# Altium schematic sheet Структурная схема.SchDoc
size 420 x 297 mm; CheckedBy: С. И. Ян; Author: Я.В. Калистратов; CompanyName: ГУАП; DocumentNumber: 1; Revision: 1; SheetNumber: 1; SheetTotal: 1; Name2: контролера БПЛА; Name1: Структурная схема полётного; Parameter 1: вапвап
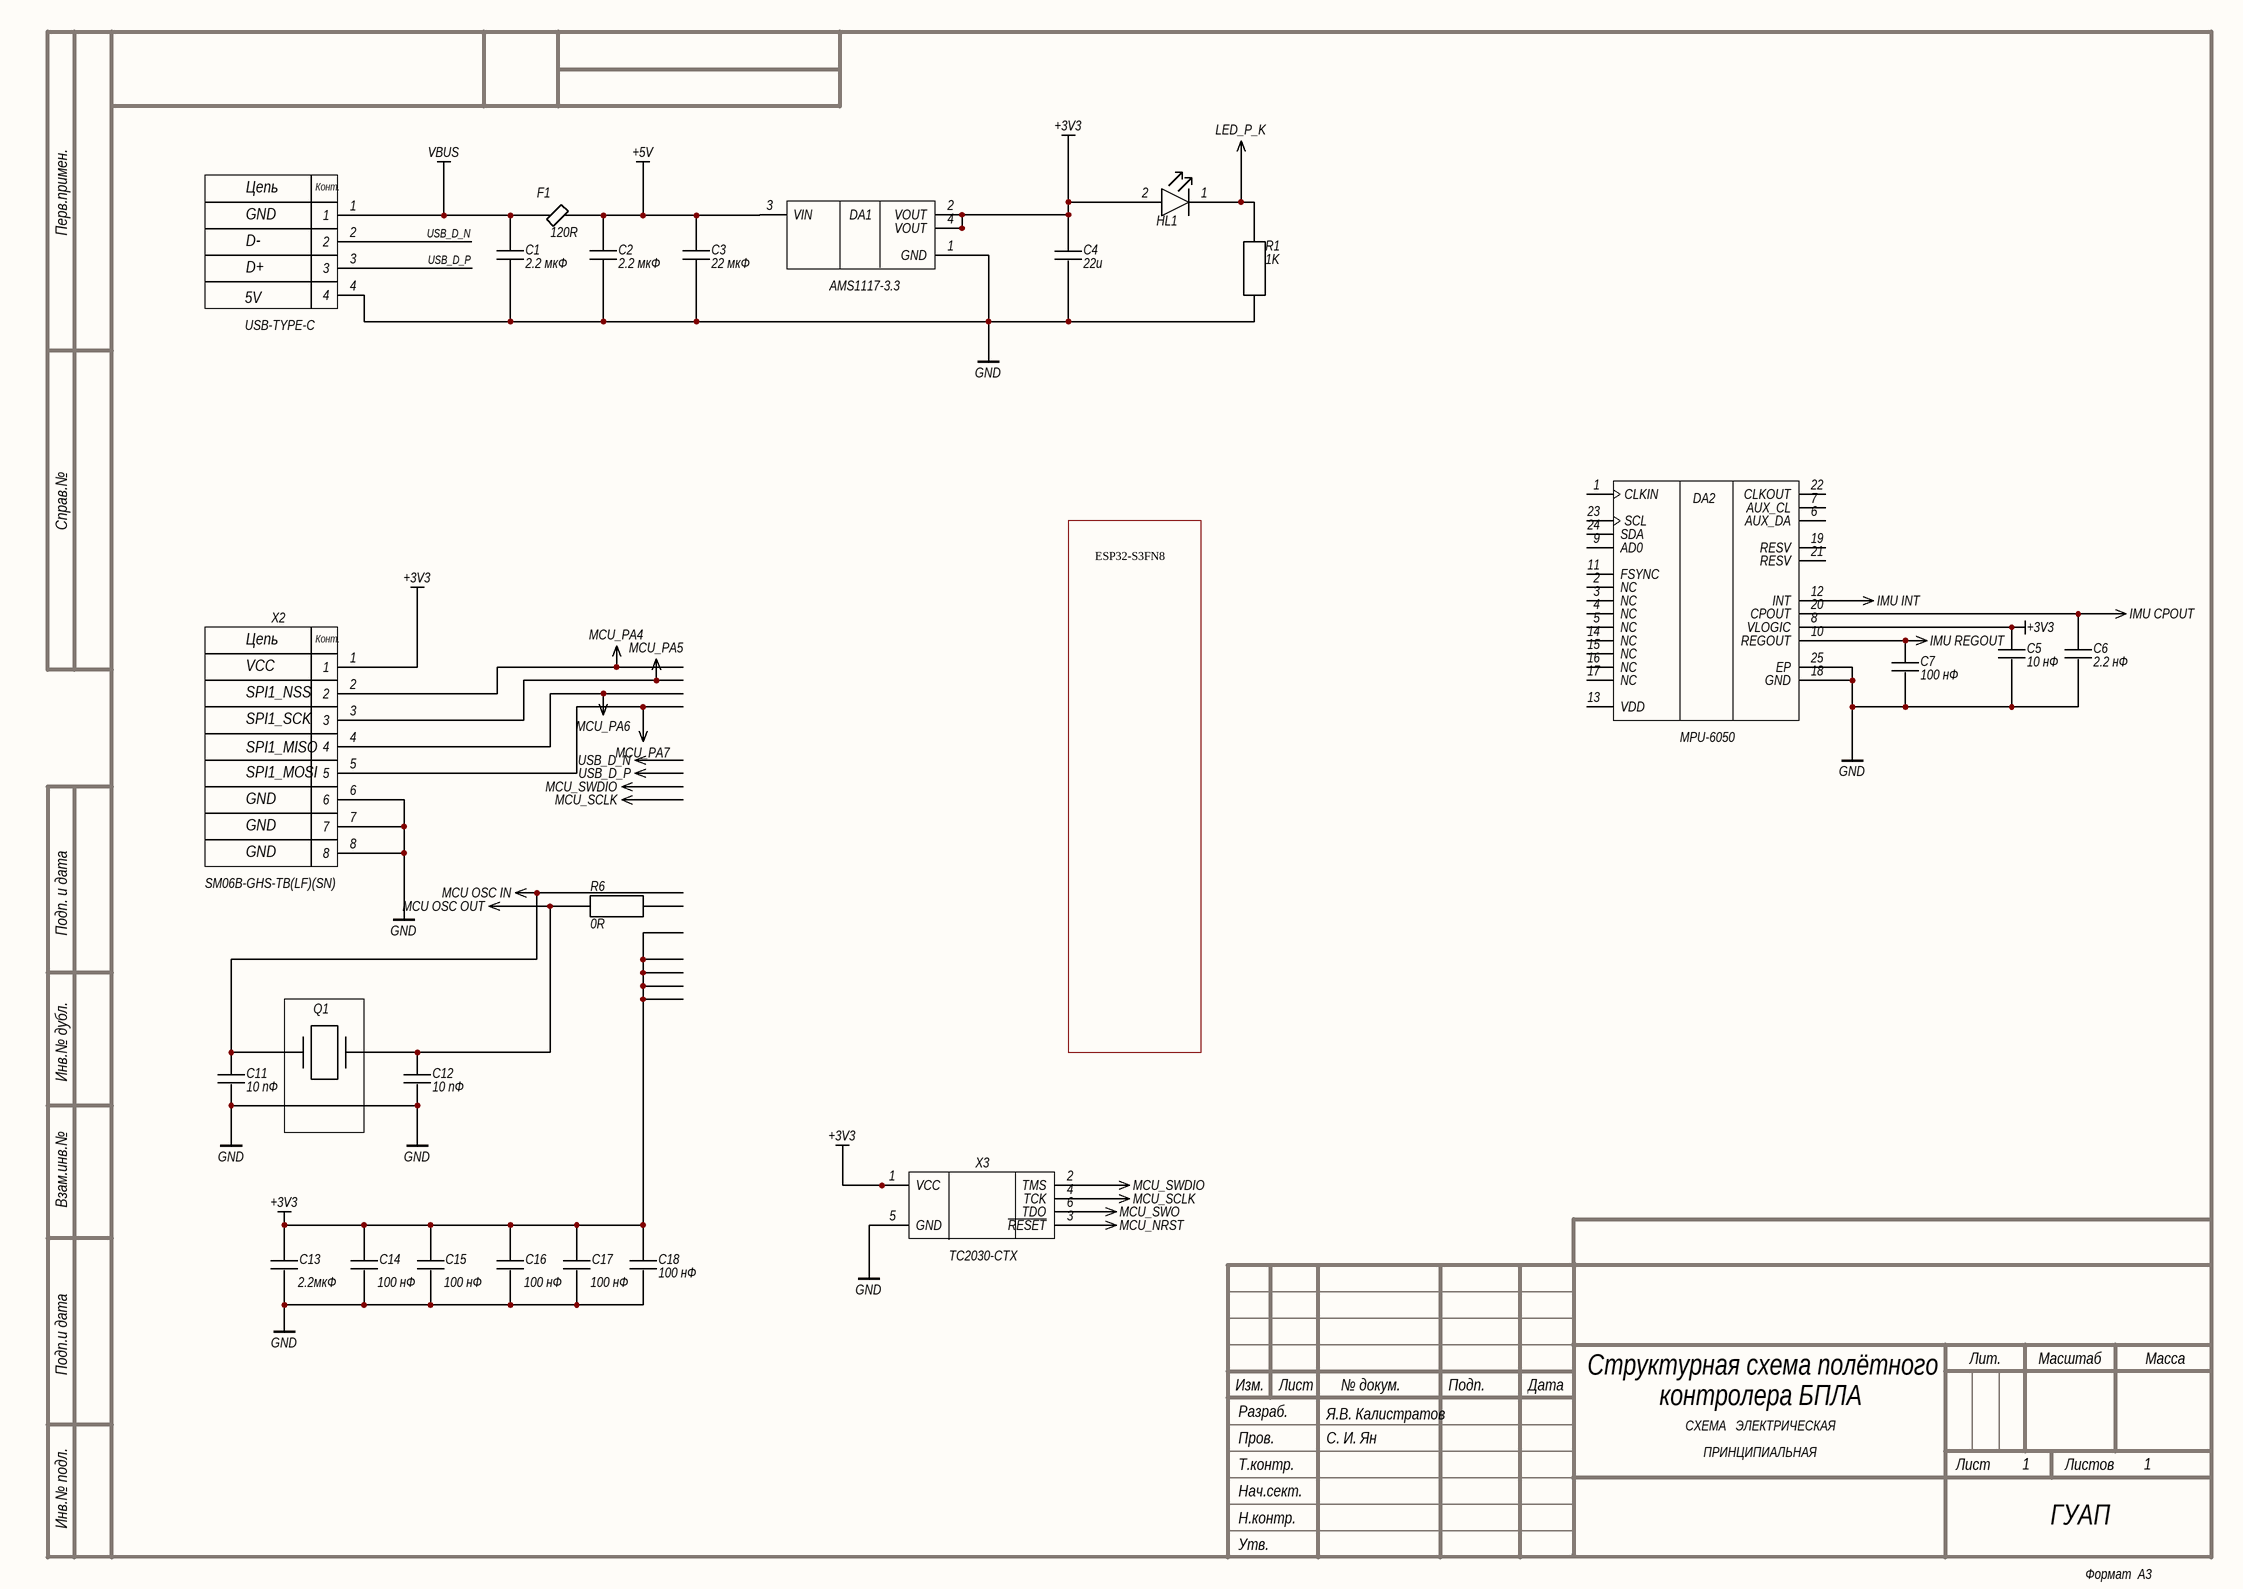
[diagram p0: Структурная схема.SchDoc]

## Parts
?  USB-TYPE-C  [FP-473460001-MFG]
C1  2.2 мкФ  [FP-GRM15-MFG]
C2  2.2 мкФ  [FP-GRM15-MFG]
C3  22 мкФ  [FP-0805-L_2_01_0_2-W_1_25-IPC_C]
C4  22u  [FP-0805-L_2_01_0_2-W_1_25-IPC_C]
C5  10 нФ  [FP-GRM15-MFG]
C6  2.2 нФ  [FP-GRM15-MFG]
C7  100 нФ  [FP-GRM15-MFG]
C11  10 пФ  [FP-GRM15-MFG]
C12  10 пФ  [FP-GRM15-MFG]
C13  2.2мкФ  [FP-0805-L_2_01_0_2-W_1_25-IPC_C]
C14  100 нФ  [FP-0805-L_2_01_0_2-W_1_25-IPC_C]
C15  100 нФ  [FP-0805-L_2_01_0_2-W_1_25-IPC_C]
C16  100 нФ  [FP-0805-L_2_01_0_2-W_1_25-IPC_C]
C17  100 нФ  [FP-0805-L_2_01_0_2-W_1_25-IPC_C]
C18  100 нФ  [FP-0805-L_2_01_0_2-W_1_25-IPC_C]
DA1  AMS1117-3.3  [FP-AMS1117-IPC_C]
DA2  MPU-6050  [IS-QFN-24_V]
F1  120R  [FP-BLM18-0_15-t0_8-IPC_C]
HL1  SML-P11MTT86  [FP-SML-P11MTT86-MFG]  (value not drawn)
Q1  TSX-3225 24.0000MF15X-AC3  [EPSON-TSX-3225_V]  (value not drawn)
R1  1K  [FP-CRCW0402-e3-IPC_C]
R6  0R  [FP-CRCW0402-e3-IPC_C]
X2  SM06B-GHS-TB(LF)(SN)  [FP-SM06B-GHS-TB_LF_SN-MFG]
X3  TC2030-CTX  [TC2030-IDC-NL]

## Nets
+3V3: C4.1 C5.2 C13.1 C14.1 C15.1 C16.1 C17.1 C18.1 DA1.2(VOUT) DA1.4(VOUT) DA2.8(VLOGIC) HL1.2(A) X2.1 X3.1(VCC)
+5V: C2.2 C3.1 DA1.3(VIN) F1.2
GND: ?.4 C1.1 C2.1 C3.2 C4.2 C5.1 C6.1 C7.1 C11.1 C12.1 C13.2 C14.2 C15.2 C16.2 C17.2 C18.2 DA1.1(GND) DA2.18(GND) DA2.25(EP) Q1.2(GND) Q1.4(GND) R1.1(PIN) X2.6 X2.7 X2.8 X3.5(GND)
IMU CPOUT: C6.2 DA2.20(CPOUT)
IMU INT: DA2.12(INT)
IMU REGOUT: C7.2 DA2.10(REGOUT)
LED_P_K: HL1.1(C) R1.2(PIN)
MCU OSC IN: C11.2 Q1.1(IN)
MCU OSC OUT: C12.2 Q1.3(OUT) R6.2(PIN)
MCU_NRST: X3.3(~{RESET})
MCU_PA4: X2.2
MCU_PA5: X2.3
MCU_PA6: X2.4
MCU_PA7: X2.5
MCU_SCLK: X3.4(TCK)
MCU_SWDIO: X3.2(TMS)
MCU_SWO: X3.6(TDO)
USB_D_N: ?.2
USB_D_P: ?.3
VBUS: ?.1 C1.2 F1.1

Not connected (* = marked no-connect by the designer): DA2 1(CLKIN) 2(NC) 3(NC) 4(NC) 5(NC) 6(AUX_DA) 7(AUX_CL) 9(AD0) 11(FSYNC) 13(VDD) 14(NC) 15(NC) 16(NC) 17(NC) 19(RESV) 21(RESV) 22(CLKOUT) 23(SCL) 24(SDA); R6 1(PIN)

## Notes on the sheet
- Цепь
- Конт.
- GND
- D-
- 5V
- D+
- ESP32-S3FN8
- (near X2) Конт.
- VCC
- (near X2) SPI1_NSS
- (near X2) SPI1_SCK
- (near X2) SPI1_MISO
- (near X2) SPI1_MOSI
- Перв.примен.
- Справ.№
- Подп. и дата
- Инв.№ дубл.
- Взам.инв.№
- Подп.и дата
- Разраб.
- Изм.
- Лист
- № докум.
- Подп.
- Дата
- Лит.
- Масштаб
- Масса
- Т.контр.
- Пров.
- СХЕМА   ЭЛЕКТРИЧЕСКАЯ
- ПРИНЦИПИАЛЬНАЯ
- Листов
- Инв.№ подл.
- Утв.
- Н.контр.
- Нач.сект.
- Формат  A3

## Library data of the parts
? = CMP-2000-05246-2: CONN RCPT USB2.0 MICRO B SMD R/A; Manufacturer: Molex; Manufacturer Part Number: 473460001; Conn Orientation: Right Angle; Is Female: yes; Shielding: true; Pitch: 0.65mm; Number Of Contacts: 5; Voltage Rating: 30V; Current Rating: 1.8A; Device Class L2: USB Connectors; Digikey Description: CONN RCPT USB2.0 MICRO B SMD R/A; Height: 2.945mm; RoHS: TRUE; ComponentLink2Description: Datasheet; Octopart: https://octopart.com/47346-0001-molex-7164928; Automotive: No; Package: 0; Category: Conn; Device Class L1: Connectors; Usb Standard: USB 2.0; Temperature: -30°C to +85°C; Temperature Range Low: -30°C; Footprint Url: https://www.molex.com/pdm_docs/sd/473460001_sd.pdf; ComponentLink2URL: https://www.molex.com/webdocs/datasheets/pdf/en-us/0473460001_IO_CONNECTORS.pdf; Lead Free: Yes; Contact Material: Gold,Nickel; Temperature Range High: +85°C; Device Class L3: unset
C1 C2 C5-C7 C11 C12 = CMP-2100-03641-2: CAP CER 0.1UF 16V X7R 0402; Manufacturer Part Number: GRM155R71C104KA88D; Manufacturer: Murata; Standoff Height: 0mm; Tolerance: 10%; Voltage Rating: 16Vdc; Material: Ceramic; Capacitance: 0.10μF; Value: 0.10μF; RoHS: TRUE; Temperature Characteristic: X7R; Octopart: https://octopart.com/grm155r71c104ka88d-murata-196880; Digikey Description: CAP CER 0.1UF 16V X7R 0402; Device Class L3: Ceramic Capacitors; Height: 0.55mm; ComponentLink2Description: Datasheet; Temperature Range Low: -55°C; Ipc Land Pattern Name: CAPC10050X219; ComponentLink2URL: https://search.murata.co.jp/Ceramy/image/img/A01X/G101/ENG/GRM155R71H471KA01-01A.pdf; Device Class L1: Passive Components; Lead Free: yes; Category: Cap; Package: GRM15; Temperature: -55°C to +125°C; Device Class L2: Capacitors; Temperature Range High: +125°C; Mouser Description: 0402 0.1 uF 16V ±10 % Tolerance X7R SMT Multilayer Ceramic Capacitor
C3 C4 C13-C18 = CMP-2000-05016-2: General Purpose Ceramic Capacitor, 0805, 100nF, 10%, X7R, 0.15, 50V; Dissipation Factor: 2.5%; Insulation Resistance: 100GR; Voltage Rating (DC): 50V; Package Quantity: 4000; Tolerance: 10%; Voltage Rating: 50V; Dielectric: X7R; Case/Package: 0805; Lead Free: Lead Free; Dielectric Material: Ceramic; Thickness: 0.037inch; Weight: 0.001411oz; Max Operating Temperature: 125°C; REACH SVHC: No SVHC; Mount: Surface Mount; RoHS Compliant: Yes; Depth: 1.25mm; Height: 0.5mm; Case Code (Metric): 2012; Length: 2mm; Termination: Standard; Case Code (Imperial): 0805; Number of Pins: 2; Voltage: 50V; Radiation Hardening: No; Min Operating Temperature: -55°C; Capacitance: 100nF; Width: 1.2mm; Series: MLCC X7R; Packaging: Cut Tape
DA1 = CMP-209535-000001-1: LDO Voltage Regulators 1A, 3.3V; Manufacturer: Advanced Monolithic Systems; Dropout Voltage: 1.1V; Output Type: Fixed; Nominal Supply Current: 5mA; Max Power Dissipation: 1.2W; Max Supply Voltage: 15V; Number Of Outputs: 1; Standoff Height: 0.64mm; Max Junction Temp: +125°C; Height: 1.8mm; Package: AMS1117; Device Class L2: Power Management ICs; ComponentLink2Description: Datasheet; ComponentLink2URL: http://www.advanced-monolithic.com/pdf/ds1117.pdf; Category: IC; RoHS: TRUE; Automotive: No; Device Class L1: Integrated Circuits (ICs); Output Current: 1A; Device Class L3: Voltage Regulators - Linear; Temperature: -40°C to +125°C; Output Voltage: 3.3V; Manufacturer Part Number: AMS1117-3.3; Temperature Range Low: -40°C; Octopart: https://octopart.com/ams1117-3.3-advanced+monolithic+systems-25899300; Lead Free: Yes; Ipc Land Pattern Name: SOT229P700X180-4; Temperature Range High: +125°C
DA2 = CMP-1753-00002-2: 3-Axis Gyroscope, Accelerometer and a Digital Motion Processor(TM) (DMP), 2.375 to 3.46 V, -40 to 85 degC, 24-Pin QFN, RoHS, Tape and Reel; Manufacturer: InvenSense; Featured Product: MPU-60506-Axis,IntegratedI²CSolution; Other Names: 1428-1007-2 / MPU6050; Sensor Type: MotionTracking; Online Catalog: MPU-6000™Series; Unit PriceUSD: Digital; Datasheet Version: Rev. 3.3, 05/2012; Category: Sensors,Transducers; Datasheet URL: http://datasheet.octopart.com/MPU-6050-InvenSense-datasheet-14421344.pdf; Family: Multifunction; Standard Package: 5,000; Manufacturer URL: http://www.invensense.com/; Output Type: Digital; Dynamic Catalog: MPU-6000™Series
F1 = CMP-0686-00425-3: Chip Ferrite Bead, 0603, 5Ω @ 100MHz, 0.05Ω, 25%, 800mA; Shielding: Unshielded; Impedance: 5R; Max Current Rating: 700mA; DC Resistance (DCR): 50mR; Number of Lines: 1; Number of Pins: 2; Case Code (Metric): 1608; Radiation Hardening: No; Case Code (Imperial): 0603; Width: 0.8mm; Case/Package: 0603; Min Operating Temperature: -55°C; Test Frequency: 100MHz; Material: Ferrite; Package Quantity: 1; DC Current: 700mA; Lead Free: Lead Free; Number of Circuits: 1; Length: 1.6mm; Current Rating: 700mA; Military Standard: Not; Packaging: Tape and Reel; Max DC Current: 700mA; Height: 0.8mm; Depth: 0.8mm; Core Material: Ferrite; Tolerance: 25%; REACH SVHC: No SVHC; Termination: SMD/SMT; Max Operating Temperature: 125°C
HL1 = CMP-2000-07126-2: LED YELLOW/GREEN CLEAR 1006 SMD; Forward Current: 20mA; Lens Color: Colorless; Power Rating: 54mW; Lens Style: Diffused; Wavelength: 569nm; Viewing Angle: 150°; Number of LEDs: 1; Test Current: 1mA; Luminous Intensity: 2.1mcd; Illumination Color: Green; Forward Voltage: 1.9V; REACH SVHC: No SVHC; Mount: Surface Mount; Series: PicoLED™; Case Code (Imperial): 0402; Min Operating Temperature: -40°C; Max Operating Temperature: 85°C; Number of Pins: 2; Package Quantity: 1; Height: 0.25mm; Lens Transparency: Clear; Case Code (Metric): 1005; Packaging: Tape and Reel; Width: 0.6mm; Radiation Hardening: No; Case/Package: 0402; Lead Free: Lead Free; Color: Green; RoHS Compliant: Yes; Length: 1mm; Dominant Wavelength: 569nm
Q1 = CMP-2000-07333-1: MHz Range Crystal, 24 MHz, -40 to 85 degC, 4-Pin SMD, RoHS, Tape and Reel; Manufacturer: Epson; Brand: EpsonTiming; Frequency Stability: 10PPM; Frequency: 24MHz; ESR: 40Ohms; Load Capacitance: 9pF; Unit Weight: 0.000564oz; Drive Level: 200uW; Datasheet Version: 12/2015; RoHS: True; Operating Temperature Range: -40Cto+85C; Length: 3.2mm; Tolerance: 10PPM; Width: 2.5mm; Mounting Technology: SurfaceMount; Package Description: 4-Pin Surface Mount Device, Body 3.2 x 2.5 mm; Manufacturer URL: https://www.eea.epson.com/; Factory Pack Quantity: 250; Package Reference: TSX-3225; Height: 0.6mm; Mounting Style: SMD/SMT; Termination Style: SMD/SMT; Datasheet URL: https://support.epson.biz/td/api/doc_check.php?dl=brief_FA-238V_en.pdf; Type: Crystal; Series: TSX-3225; Package / Case: 3.2mmx2.5mm; Product Category: Crystals; Packaging: Reel
R1 R6 = CMP-2002-08122-2: RES Thick Film, 0Ω, 0.063W, 0402; Tolerance: 5%; Max Power Dissipation: 63mW; Voltage Rating: 50V; Temperature Coefficient: 100ppm/°C; Resistance: 0mR; Contact Plating: Tin; Height: 0.35mm; Radiation Hardening: No; Features: Automotive AEC-Q200; Composition: Thick Film; Width: 0.5mm; Weight: 2.3E-05oz; Termination: SMD/SMT; Packaging: Tape and Reel; Mount: Surface Mount; Case Code (Metric): 1005; Military Standard: Not; Min Operating Temperature: -55°C; Number of Terminations: 2; Package Quantity: 1; Case Code (Imperial): 0402; Depth: 0.5mm; Max Operating Temperature: 155°C; Case/Package: 0402; Power Rating: 63mW; Lead Free: Lead Free; Voltage Rating (DC): 50V; Length: 1mm
X2 = CMP-17439-000061-1: CONN HEADER SMD R/A 6POS 1.25MM; Number of Contacts: 6; Voltage Rating: 50V; Current Rating: 1A; Connector Type: Outer Shroud Contact; Contact Resistance: 50mR; Orientation: Right Angle; Max Operating Temperature: 85°C; Mount: Surface Mount; Packaging: Tape and Reel; Contact Plating: Tin; Depth: 4.05mm; Max Voltage Rating (AC): 50V; Lead Free: Lead Free; Pitch: 1.25mm; Number of Positions: 6; Max Current Rating: 1A; Termination: Solder; Min Operating Temperature: -25°C; Housing Color: Beige; Fastening Type: Ramp; Length: 10.75mm; Color: Natural; Contact Material: Bronze; Housing Material: Polyamide; Number of Rows: 1
X3 = CMP-003-000000-1: CortexÂ® Plug-Of-Nailsâ„¢ Adapter Cable; MF: Tag-Connect LLC; Price: None; Value: *; Source: SnapEDAsch.SchLib; Availability: Unavailable; SnapEDA_Link: https://www.snapeda.com/parts/TC2030-CTX/Tag-Connect%20LLC/view-part/225831/?ref=snap; Package: None; Component Type: Standard; MP: TC2030-CTX; Design Item ID: TC2030-CTX; Pin Count: 6